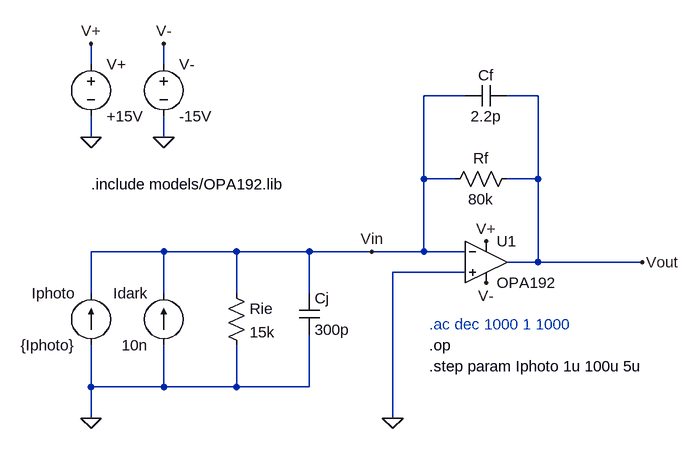
[diagram p0: schematic preamp-final.asc]
preamp-final.asc, the LTspice schematic file:
Version 4
SHEET 1 904 680
WIRE -80 64 -80 32
WIRE 32 64 32 32
WIRE 496 112 432 112
WIRE 608 112 560 112
WIRE -80 176 -80 144
WIRE 32 176 32 144
WIRE 432 240 432 112
WIRE 480 240 432 240
WIRE 608 240 608 112
WIRE 608 240 560 240
WIRE 32 352 -80 352
WIRE 144 352 32 352
WIRE 256 352 144 352
WIRE 352 352 256 352
WIRE 432 352 432 240
WIRE 432 352 352 352
WIRE 496 352 432 352
WIRE 608 368 608 240
WIRE 608 368 560 368
WIRE 768 368 608 368
WIRE 496 384 384 384
WIRE -80 416 -80 352
WIRE 32 416 32 352
WIRE 144 416 144 352
WIRE 256 416 256 352
WIRE -80 560 -80 496
WIRE 32 560 32 496
WIRE 32 560 -80 560
WIRE 144 560 144 496
WIRE 144 560 32 560
WIRE 256 560 256 480
WIRE 256 560 144 560
WIRE -80 608 -80 560
WIRE 384 608 384 384
FLAG -80 176 0
FLAG 32 176 0
FLAG 32 32 V-
FLAG -80 32 V+
FLAG -80 608 0
FLAG 384 608 0
FLAG 528 336 V+
FLAG 528 400 V-
FLAG 352 352 Vin
FLAG 768 368 Vout
SYMBOL voltage -80 48 R0
SYMATTR InstName V+
SYMATTR Value +15V
SYMBOL voltage 32 48 R0
SYMATTR InstName V-
SYMATTR Value -15V
SYMBOL current -80 496 R180
WINDOW 0 24 80 Left 2
WINDOW 3 24 0 Left 2
SYMATTR InstName Iphoto
SYMATTR Value {Iphoto}
SYMATTR Value2 AC 100u
SYMBOL current 32 496 R180
WINDOW 0 24 80 Left 2
WINDOW 3 24 0 Left 2
SYMATTR InstName Idark
SYMATTR Value 10n
SYMBOL res 128 400 R0
SYMATTR InstName Rie
SYMATTR Value 15k
SYMBOL cap 240 416 R0
SYMATTR InstName Cj
SYMATTR Value 300p
SYMBOL Opamps/opamp2 528 304 R0
SYMATTR InstName U1
SYMATTR Value OPA192
SYMBOL cap 560 96 R90
WINDOW 0 0 32 VBottom 2
WINDOW 3 32 32 VTop 2
SYMATTR InstName Cf
SYMATTR Value 2.2p
SYMBOL res 576 224 R90
WINDOW 0 0 56 VBottom 2
WINDOW 3 32 56 VTop 2
SYMATTR InstName Rf
SYMATTR Value 80k
TEXT -80 248 Left 2 !.include models/OPA192.lib
TEXT 440 464 Left 2 ;.ac dec 1000 1 1000
TEXT 440 496 Left 2 !.op
TEXT 440 528 Left 2 !.step param Iphoto 1u 100u 5u

The netlist it stands for:
* preamp-final.asc
V+ V+ 0 +15V
V- V- 0 -15V
Iphoto 0 Vin {Iphoto} AC 100u
Idark 0 Vin 10n
Rie Vin 0 15k
Cj Vin 0 300p
XU1 0 Vin V+ V- Vout OPA192  ; pins In+ In- V+ V- OUT
Cf Vout Vin 2.2p
Rf Vout Vin 80k
.include models/OPA192.lib
* .ac dec 1000 1 1000
.op
.step param Iphoto 1u 100u 5u
.backanno
.end